# EAGLE schematic Laser-Battle-IR-Sensor (EAGLE 7.5.0)
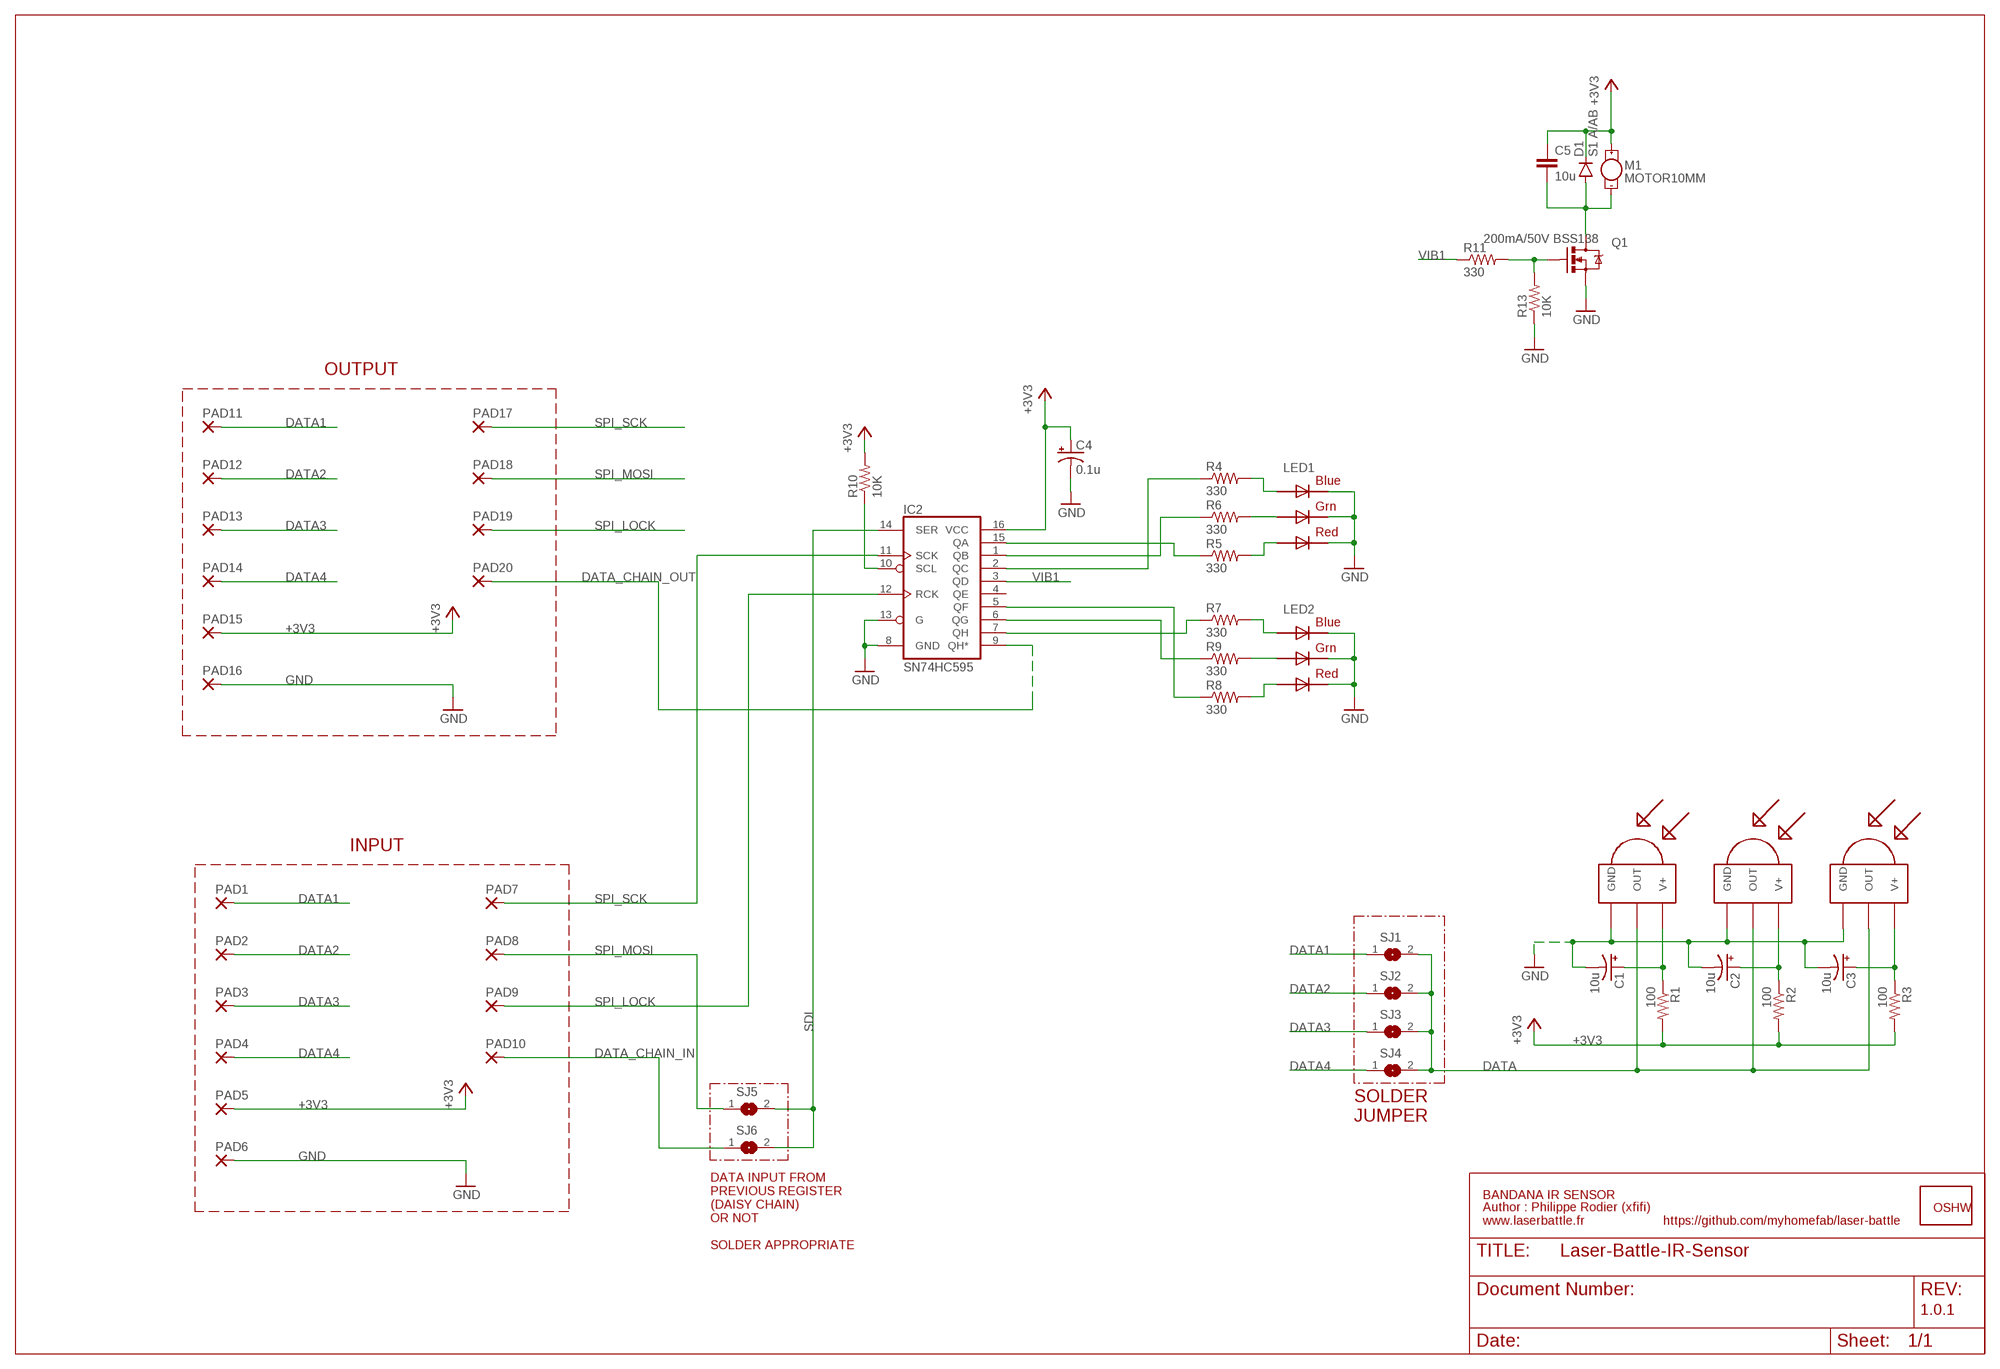
[diagram p0: schematic, sheet 1]

## Parts
C1  10u  CAP_POL1206  [EIA3216]
C2  10u  CAP_POL1206  [EIA3216]
C3  10u  CAP_POL1206  [EIA3216]
C4  0.1u  CAP_POL1206  [EIA3216]
C5  10u  CAP0603-CAP  [0603-CAP]
D1  S1 A/AB  DIODESMA  [SMA-DIODE]
GOLD_ORB_SM1  OSHWLOGO_GOLD_ORB_SM  [OSHW2]
IC2  SN74HC595  74595  [TSSOP16]
IR1  TSOP4856  [TSOP18XX]
IR2  TSOP4856  [TSOP18XX]
IR3  TSOP4856  [TSOP18XX]
LED1  RGBLED5050  [RGBLED5050]
LED2  RGBLED5050  [RGBLED5050]
M1  MOTOR10MM  [VIBE-MOTOR-10MM]
PAD1  1,6/0,8  [1,6/0,8]
PAD2  1,6/0,8  [1,6/0,8]
PAD3  1,6/0,8  [1,6/0,8]
PAD4  1,6/0,8  [1,6/0,8]
PAD5  1,6/0,8  [1,6/0,8]
PAD6  1,6/0,8  [1,6/0,8]
PAD7  1,6/0,8  [1,6/0,8]
PAD8  1,6/0,8  [1,6/0,8]
PAD9  1,6/0,8  [1,6/0,8]
PAD10  1,6/0,8  [1,6/0,8]
PAD11  1,6/0,8  [1,6/0,8]
PAD12  1,6/0,8  [1,6/0,8]
PAD13  1,6/0,8  [1,6/0,8]
PAD14  1,6/0,8  [1,6/0,8]
PAD15  1,6/0,8  [1,6/0,8]
PAD16  1,6/0,8  [1,6/0,8]
PAD17  1,6/0,8  [1,6/0,8]
PAD18  1,6/0,8  [1,6/0,8]
PAD19  1,6/0,8  [1,6/0,8]
PAD20  1,6/0,8  [1,6/0,8]
Q1  200mA/50V BSS138  MOSFET-NCHANNELBSS138  [SOT23-3]
R1  100  100OHM-1/10W-1%(0603)  [0603-RES]
R2  100  100OHM-1/10W-1%(0603)  [0603-RES]
R3  100  100OHM-1/10W-1%(0603)  [0603-RES]
R4  330  3.3KOHM1/10W1%(0603)  [0603-RES]
R5  330  3.3KOHM1/10W1%(0603)  [0603-RES]
R6  330  3.3KOHM1/10W1%(0603)  [0603-RES]
R7  330  3.3KOHM1/10W1%(0603)  [0603-RES]
R8  330  3.3KOHM1/10W1%(0603)  [0603-RES]
R9  330  3.3KOHM1/10W1%(0603)  [0603-RES]
R10  10K  10KOHM-1/10W-1%(0603)0603  [0603-RES]
R11  330  330OHM1/10W1%(0603)  [0603-RES]
R13  10K  10KOHM-1/10W-1%(0603)0603  [0603-RES]
SJ1  SJ  [SJ]
SJ2  SJ  [SJ]
SJ3  SJ  [SJ]
SJ4  SJ  [SJ]
SJ5  SJ  [SJ]
SJ6  SJ  [SJ]

## Nets
+3V3: C4.A(+) C5.1 D1.C IC2.16(VCC) M1.+ PAD5.1(P) PAD15.1(P) R1.2 R2.2 R3.2 R10.2
DATA: IR1.OUT IR2.OUT IR3.OUT SJ1.2 SJ2.2 SJ3.2 SJ4.2
DATA1: PAD1.1(P) PAD11.1(P) SJ1.1
DATA2: PAD2.1(P) PAD12.1(P) SJ2.1
DATA3: PAD3.1(P) PAD13.1(P) SJ3.1
DATA4: PAD4.1(P) PAD14.1(P) SJ4.1
DATA_CHAIN_IN: PAD10.1(P) SJ6.1
DATA_CHAIN_OUT: IC2.9(QH*) PAD20.1(P)
GND: C1.C(-) C2.C(-) C3.C(-) C4.C(-) IC2.8(GND) IC2.13(G) IR1.GND IR2.GND IR3.GND LED1.4(BLUE_C) LED1.5(RED_C) LED1.6(GREEN_C) LED2.4(BLUE_C) LED2.5(RED_C) LED2.6(GREEN_C) PAD6.1(P) PAD16.1(P) Q1.2(S) R13.1
N$1: C3.A(+) IR3.VCC(V+) R3.1
N$2: C2.A(+) IR2.VCC(V+) R2.1
N$3: IC2.10(SCL) R10.1
N$4: C1.A(+) IR1.VCC(V+) R1.1
N$6: LED1.3(BLUE_A) R4.2
N$7: LED1.1(GREEN_A) R6.2
N$8: LED1.2(RED_A) R5.2
N$9: LED2.3(BLUE_A) R7.2
N$10: LED2.1(GREEN_A) R9.2
N$11: LED2.2(RED_A) R8.2
N$12: IC2.15(QA) R5.1
N$13: IC2.1(QB) R6.1
N$14: IC2.2(QC) R4.1
N$15: IC2.5(QF) R8.1
N$16: IC2.6(QG) R9.1
N$17: IC2.7(QH) R7.1
N$18: C5.2 D1.A M1.- Q1.3(D)
N$19: Q1.1(G) R11.2 R13.2
SDI: IC2.14(SER) SJ5.2 SJ6.2
SPI_LOCK: IC2.12(RCK) PAD9.1(P) PAD19.1(P)
SPI_MOSI: PAD8.1(P) PAD18.1(P) SJ5.1
SPI_SCK: IC2.11(SCK) PAD7.1(P) PAD17.1(P)
VIB1: IC2.3(QD) R11.1
Unconnected: IC2.4(QE)

## Notes on the sheet
- OUTPUT
- INPUT
- SOLDER
  JUMPER
- BANDANA IR SENSOR
- Author : Philippe Rodier (xfifi)
  www.laserbattle.fr
- https://github.com/myhomefab/laser-battle
- DATA INPUT FROM
  PREVIOUS REGISTER
  (DAISY CHAIN)
  OR NOT
  
  SOLDER APPROPRIATE
- 1.0.1

## Library data of the parts
C1-C4 = SparkFun-Passives:CAP_POL: Capacitor Polarized These are standard SMD and PTH capacitors. Normally 10uF, 47uF, and 100uF in electrolytic and tantalum varieties. Always verify the external diameter of the through hole cap, it varies with capacity, voltage, and manufacturer. The EIA devices should be standard.
C5 = SparkFun-Passives:CAP: Capacitor Standard 0603 ceramic capacitor, and 0.1" leaded capacitor.
D1 = SparkFun-DiscreteSemi:DIODE: Diode These are standard reverse protection diodes and small signal diodes. SMA package can handle up to about 1A. SOD-323 can handle about 200mA. What the SOD-323 package when ordering, there are some mfgs out there that are 5-pin packages.
GOLD_ORB_SM1 = NBitWonder:OSHWLOGO: These are Open-Source Hardware logos.
IC2 = SparkFun-DigitalIC:74*595: 8-bit SHIFT REGISTER, output latch
IR1-IR3 = tsop:TSOP4856: IR Receiver and Demodulator
LED1 LED2 = adafruit:RGBLED: For 5050 RGB LEDs, the order of the LEDs may vary from one manufacturer to another!
M1 = SparkFun-Electromechanical:MOTOR: Vibration Motor- ROB-08449 Physical dimension and wire connections for this powerful vibration motor. Motor has a self adhesive backing.
PAD1-PAD20 = wirepad:1,6/0,8: THROUGH-HOLE PAD
Q1 = SparkFun-DiscreteSemi:MOSFET-NCHANNEL: Common NMOSFET Parts MFG P/N Store ID Prod ID FDD8780 TRANS-09984 SI7820DN TRANS-11055 FDS6630A IC-08089 2N7002PW TRANS-11151 FQP30N06L COM-10213 TRANS-10060 BSS123LT1G TRANS-08345 BSS138 TRANS-00830 BS170 2N7000; PROD_ID: TRANS-00830; VALUE: 200mA/50V
R1-R3 = SparkFun-Resistors:100OHM-1/10W-1%(0603): RES-07863; PROD_ID: RES-07863
R4-R9 = SparkFun-Resistors:3.3KOHM1/10W1%(0603): RES-07851; PROD_ID: RES-07851
R10 R13 = SparkFun-Resistors:10KOHM-1/10W-1%(0603): RES-00824; PROD_ID: RES-00824
R11 = SparkFun-Resistors:330OHM1/10W1%(0603): RES-00818; PROD_ID: RES-00818
SJ1-SJ6 = jumper:SJ: SMD solder JUMPER